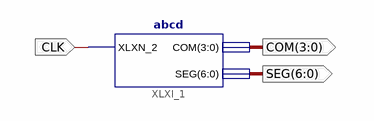
[diagram p0: schematic sheet 1]
// Xilinx ISE schematic main.sch (spartan6) as structural Verilog: 1 symbols, 3 ports
module main (
  input  CLK,
  output [3:0] COM,
  output [6:0] SEG
);

  abcd XLXI_1 (.XLXN_2(CLK), .COM(COM), .SEG(SEG));
endmodule
